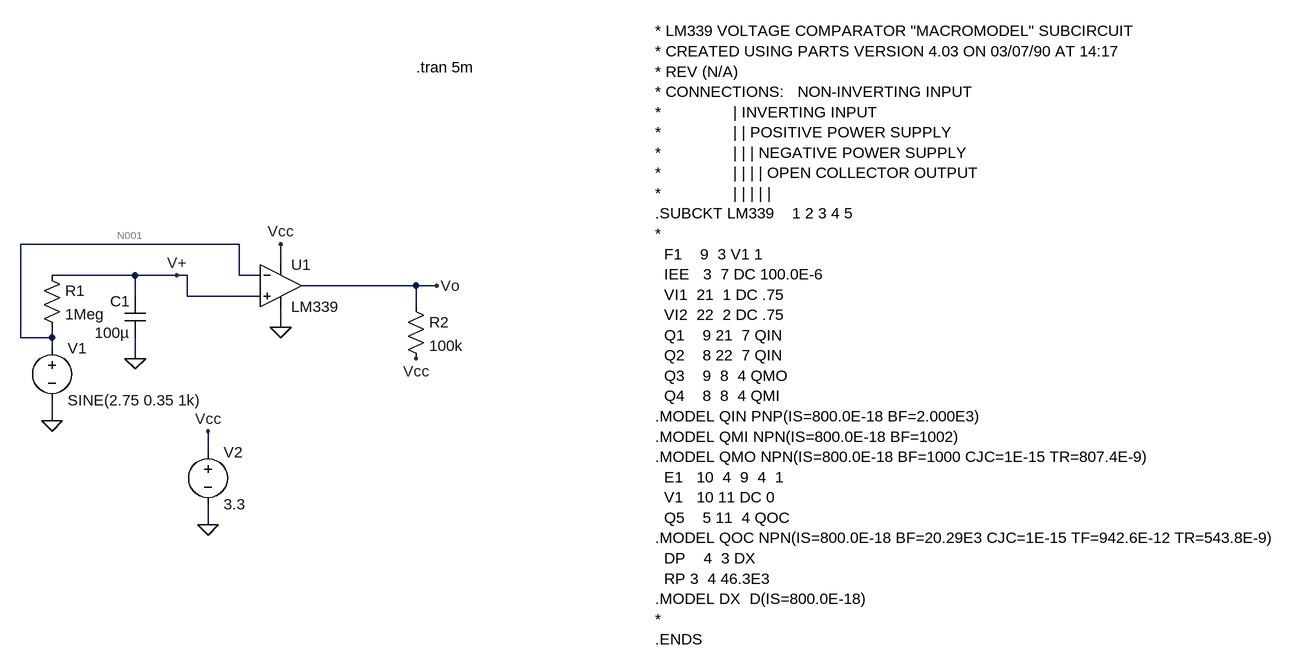
[diagram p0: schematic SchmittTriggerComp.asc]
SchmittTriggerComp.asc, the LTspice schematic file:
Version 4
SHEET 1 1292 2048
WIRE -336 400 -672 400
WIRE -272 432 -272 400
WIRE -496 448 -624 448
WIRE -432 448 -496 448
WIRE -416 448 -432 448
WIRE -336 448 -336 400
WIRE -304 448 -336 448
WIRE -64 464 -240 464
WIRE -32 464 -64 464
WIRE -496 480 -496 448
WIRE -416 480 -416 448
WIRE -304 480 -416 480
WIRE -64 496 -64 464
WIRE -272 528 -272 496
WIRE -672 544 -672 400
WIRE -624 544 -624 528
WIRE -624 544 -672 544
WIRE -624 560 -624 544
WIRE -496 576 -496 544
WIRE -624 672 -624 640
WIRE -384 720 -384 688
WIRE -384 832 -384 800
FLAG -432 448 V+
FLAG -32 464 Vo
FLAG -624 672 0
FLAG -384 688 Vcc
FLAG -384 832 0
FLAG -64 576 Vcc
FLAG -272 528 0
FLAG -272 400 Vcc
FLAG -496 576 0
SYMBOL voltage -624 544 R0
WINDOW 123 0 0 Left 2
WINDOW 39 0 0 Left 2
SYMATTR InstName V1
SYMATTR Value SINE(2.75 0.35 1k)
SYMBOL voltage -384 704 R0
SYMATTR InstName V2
SYMATTR Value 3.3
SYMBOL res -80 480 R0
SYMATTR InstName R2
SYMATTR Value 100k
SYMBOL Opamps\\opamp2 -272 400 R0
SYMATTR InstName U1
SYMATTR Value LM339
SYMBOL res -640 432 R0
SYMATTR InstName R1
SYMATTR Value 1Meg
SYMBOL cap -480 544 R180
WINDOW 0 24 56 Left 2
WINDOW 3 24 8 Left 2
SYMATTR InstName C1
SYMATTR Value 100µ
TEXT 304 72 Left 2 !* LM339 VOLTAGE COMPARATOR "MACROMODEL" SUBCIRCUIT\n* CREATED USING PARTS VERSION 4.03 ON 03/07/90 AT 14:17\n* REV (N/A)\n* CONNECTIONS:   NON-INVERTING INPUT\n*                | INVERTING INPUT\n*                | | POSITIVE POWER SUPPLY\n*                | | | NEGATIVE POWER SUPPLY\n*                | | | | OPEN COLLECTOR OUTPUT\n*                | | | | |\n.SUBCKT LM339    1 2 3 4 5\n*\n  F1    9  3 V1 1\n  IEE   3  7 DC 100.0E-6\n  VI1  21  1 DC .75\n  VI2  22  2 DC .75\n  Q1    9 21  7 QIN\n  Q2    8 22  7 QIN\n  Q3    9  8  4 QMO\n  Q4    8  8  4 QMI\n.MODEL QIN PNP(IS=800.0E-18 BF=2.000E3)\n.MODEL QMI NPN(IS=800.0E-18 BF=1002)\n.MODEL QMO NPN(IS=800.0E-18 BF=1000 CJC=1E-15 TR=807.4E-9)\n  E1   10  4  9  4  1\n  V1   10 11 DC 0\n  Q5    5 11  4 QOC\n.MODEL QOC NPN(IS=800.0E-18 BF=20.29E3 CJC=1E-15 TF=942.6E-12 TR=543.8E-9)\n  DP    4  3 DX\n  RP 3  4 46.3E3\n.MODEL DX  D(IS=800.0E-18)\n*\n.ENDS
TEXT -64 128 Left 2 !.tran 5m

The netlist it stands for:
* SchmittTriggerComp.asc
V1 N001 0 SINE(2.75 0.35 1k)
V2 Vcc 0 3.3
R2 Vo Vcc 100k
XU1 V+ N001 Vcc 0 Vo LM339  ; pins In+ In- V+ V- OUT
R1 V+ N001 1Meg
C1 0 V+ 100µ
* LM339 VOLTAGE COMPARATOR "MACROMODEL" SUBCIRCUIT
* CREATED USING PARTS VERSION 4.03 ON 03/07/90 AT 14:17
* REV (N/A)
* CONNECTIONS:   NON-INVERTING INPUT
*                | INVERTING INPUT
*                | | POSITIVE POWER SUPPLY
*                | | | NEGATIVE POWER SUPPLY
*                | | | | OPEN COLLECTOR OUTPUT
*                | | | | |
.SUBCKT LM339    1 2 3 4 5
*
  F1    9  3 V1 1
  IEE   3  7 DC 100.0E-6
  VI1  21  1 DC .75
  VI2  22  2 DC .75
  Q1    9 21  7 QIN
  Q2    8 22  7 QIN
  Q3    9  8  4 QMO
  Q4    8  8  4 QMI
.MODEL QIN PNP(IS=800.0E-18 BF=2.000E3)
.MODEL QMI NPN(IS=800.0E-18 BF=1002)
.MODEL QMO NPN(IS=800.0E-18 BF=1000 CJC=1E-15 TR=807.4E-9)
  E1   10  4  9  4  1
  V1   10 11 DC 0
  Q5    5 11  4 QOC
.MODEL QOC NPN(IS=800.0E-18 BF=20.29E3 CJC=1E-15 TF=942.6E-12 TR=543.8E-9)
  DP    4  3 DX
  RP 3  4 46.3E3
.MODEL DX  D(IS=800.0E-18)
*
.ENDS
.tran 5m
.backanno
.end

* Results of the author's LTspice run, read from the files saved beside the schematic
* Operating Point, zero values left out:
*   V(n001) = 2.75 V
*   V(vcc) = 3.3 V
*   V(vo) = 3.3 V
*   V(v+) = 2.767 V
*   I(R1) = 17.04 nA
*   I(R2) = -3.262 pA
*   I(V2) = -171.3 µA
*   I(V1) = 49.97 nA
*   Ix(u1:1) = -17.04 nA
*   Ix(u1:2) = -32.93 nA
*   Ix(u1:3) = 171.3 µA
*   Ix(u1:4) = -171.2 µA
*   Ix(u1:5) = 3.262 pA
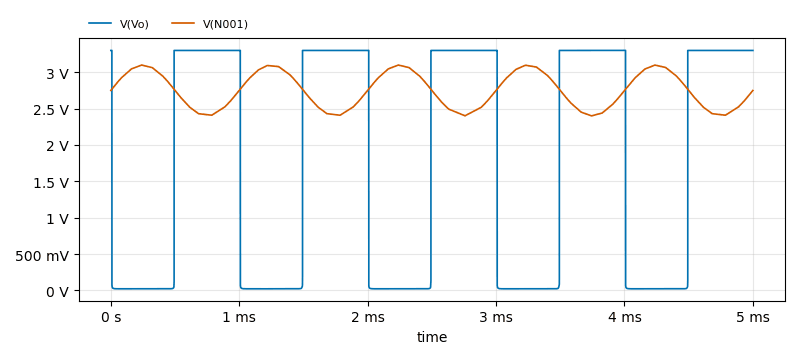
[diagram p1: Transient Analysis of SchmittTriggerComp.asc, plotted from the saved traces]
* Transient Analysis, 1 run:
*   V(Vo): min 21.85 mV, max 3.301 V, average 1.712 V, rms 2.369 V, last 3.3 V
*   V(N001): min 2.4 V, max 3.099 V, average 2.751 V, rms 2.762 V, last 2.75 V